# Altium schematic sheet AXP209.SchDoc
size A
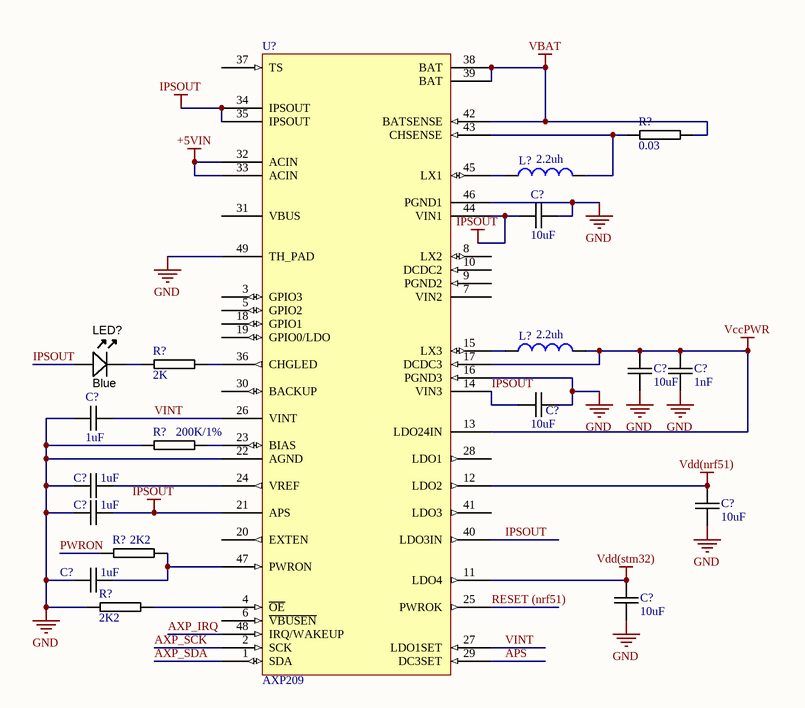
[diagram p0: AXP209.SchDoc]

## Parts
(Parts that share a designator on the sheet are numbered #1, #2 ... from top to bottom, then left to right.)
C?#1  10uF  [0603C-GENERIC]
C?#2  10uF  [0603C-GENERIC]
C?#3  1nF  [0603C-GENERIC]
C?#4  10uF  [0603C-GENERIC]
C?#5  1uF  [0603C-GENERIC]
C?#6  1uF  [0603C-GENERIC]
C?#7  10uF  [0603C-GENERIC]
C?#8  1uF  [0603C-GENERIC]
C?#9  1uF  [0603C-GENERIC]
C?#10  10uF  [0603C-GENERIC]
L?#1  2.2uh  [TAIYO_NRS4018T2R2MDGJ]
L?#2  2.2uh  [TAIYO_NRS4018T2R2MDGJ]
LED?  Blue  [LED-0805-K]
R?#1  0.03  [2512R-GENERIC]
R?#2  2K  [0603R-220K]
R?#3  200K/1%  [0603R-220K]
R?#4  2K2  [0603R-2K2]
R?#5  2K2  [0603R-2K2]
U?  AXP209  [QFN48]

## Nets
+5VIN: U?.32(ACIN) U?.33(ACIN)
GND: C?#1.2 C?#2.2 C?#3.2 C?#4.2 C?#5.1 C?#6.1 C?#7.2 C?#8.1 C?#9.1 C?#10.1 R?#3.1 R?#5.1 U?.16(PGND3) U?.22(AGND) U?.46(PGND1) U?.49(TH_PAD)
IPSOUT: C?#1.1 C?#4.1 C?#8.2 LED?.A U?.14(VIN3) U?.21(APS) U?.34(IPSOUT) U?.35(IPSOUT) U?.40(LDO3IN) U?.44(VIN1)
VBAT: R?#1.2 U?.38(BAT) U?.39(BAT) U?.42(BATSENSE)
VccPWR: C?#2.1 C?#3.1 L?#2.2 U?.13(LDO24IN) U?.17(DCDC3)
Vdd(nrf51): C?#7.1 U?.12(LDO2)
Vdd(stm32): C?#10.2 U?.11(LDO4)
APS: U?.29(DC3SET)
AXP_IRQ: U?.48(IRQ/WAKEUP)
AXP_SCK: U?.2(SCK)
AXP_SDA: U?.1(SDA)
PWRON: R?#4.1
RESET (nrf51): U?.25(PWROK)
VINT: C?#5.2 U?.26(VINT) U?.27(LDO1SET)
NetC?#6_2: C?#6.2 U?.24(VREF)
NetC?#9_2: C?#9.2 R?#4.2 U?.47(PWRON)
NetL?#1_1: L?#1.1 U?.45(LX1)
NetL?#1_2: L?#1.2 R?#1.1 U?.43(CHSENSE)
NetL?#2_1: L?#2.1 U?.15(LX3)
NetLED?_K: LED?.K R?#2.1
NetR?#2_2: R?#2.2 U?.36(CHGLED)
NetR?#3_2: R?#3.2 U?.23(BIAS)
NetR?#5_2: R?#5.2 U?.4(~{OE})

Not connected (* = marked no-connect by the designer): U? 3(GPIO3) 5(GPIO2) 6(~{VBUSEN}) 7(VIN2) 8(LX2) 9(PGND2) 10(DCDC2) 18(GPIO1) 19(GPIO0/LDO) 20(EXTEN) 28(LDO1) 30(BACKUP) 31(VBUS) 37(TS) 41(LDO3)

## Library data of the parts
C?#1 C?#2 C?#4 C?#7 C?#10 = 0603C-10UF-6V3-X5R-MUR: CAPACITOR 0603 CERAMIC; Manufacturer: Murata Electronics North America; Manufacturer Part Number: GRM188R60J106ME47D; Reel: C24; Supplier 1: Digi-Key; Supplier Part Number 1: 490-3896-2-ND
C?#3 = 0603C-1NF-50V-X7R-KEM: CAPACITOR 0603 CERAMIC; Reel: C45; Supplier 1: Digi-Key; Supplier Part Number 1: 399-1082-2-ND
C?#5 C?#6 C?#8 C?#9 = 0603C-1UF-25V-X5R-SAM: CAPACITOR 0603 CERAMIC; Reel: C17
L?#1 L?#2 = inductor_smd
LED? = LED_SMD_Blue_0805_100mcd: LED 0805 SMD Blue 100mcd 470nm; Manufacturer 1: Ligitek; Manufacturer Part Number 1: LG-170DBKZ-CT; Material: InGaN/GaN; Ratings: 100 mcd; 470 nm; Package / Case: 0805; Value: Blue; Color: Blue
R?#1 = 2512R-7R5: GENERIC RESISTOR 2512; Manufacturer Part Number: CRCW25127R50JNEG; Manufacturer: Vishay/Dale; REEL: R20; Supplier 1: Digi-Key; Supplier Part Number 1: 541-7.5XDKR-ND
R?#2 R?#3 = 0603R-220K: GENERIC RESISTOR 0603; Manufacturer: Stackpole Electronics Inc; Manufacturer Part Number: RMCF 1/16 220K 1% R; Resistance In Ohms: 220K; Power (Watts): 0.1W, 1/10W; Temperature Coefficient: ±100ppm/°C; Tolerance: ±1%; Supplier 1: Digi-Key; Supplier Part Number 1: RMCF1/16220KFR-ND; RoHS: RoHS Compliant; Composition: Thick Film; Lead Style: Surface Mount (SMD - SMT); Supplier: Digi-Key; Supplier Part Number: RMCF1/16220KFR-ND; Packaging: Tape & Reel (TR); Category: Resistors; Case: 0603 (1608 metric)
R?#4 R?#5 = 0603R-2K2: GENERIC RESISTOR 0603; Manufacturer Part Number: RMC 1/16 2.2K 1% R; Manufacturer: Stackpole Electronics Inc; REEL: R88; Supplier 1: Digi-Key; Supplier Part Number 1: RMCF0603FT2K20TR-ND